# Altium schematic sheet P_Shift.SchDoc
size E
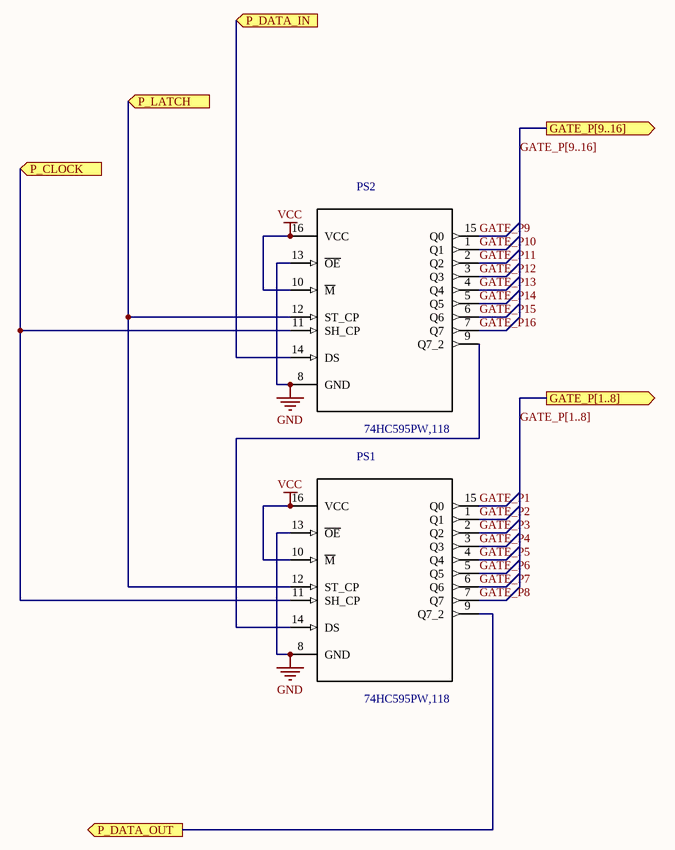
[diagram p0: P_Shift.SchDoc]

## Parts
PS1  74HC595PW,118  [SOP65P640X110-16N]
PS2  74HC595PW,118  [SOP65P640X110-16N]

## Ports
GATE_P[1..8] (out), GATE_P[9..16] (out), P_CLOCK (in), P_DATA_IN (in), P_DATA_OUT (out), P_LATCH (in)

## Nets
GND: PS1.8(GND) PS1.13(~{OE}) PS2.8(GND) PS2.13(~{OE})
VCC: PS1.10(M~{}) PS1.16(VCC) PS2.10(M~{}) PS2.16(VCC)
GATE_P1: PS1.15(Q0)
GATE_P2: PS1.1(Q1)
GATE_P3: PS1.2(Q2)
GATE_P4: PS1.3(Q3)
GATE_P5: PS1.4(Q4)
GATE_P6: PS1.5(Q5)
GATE_P7: PS1.6(Q6)
GATE_P8: PS1.7(Q7)
GATE_P9: PS2.15(Q0)
GATE_P10: PS2.1(Q1)
GATE_P11: PS2.2(Q2)
GATE_P12: PS2.3(Q3)
GATE_P13: PS2.4(Q4)
GATE_P14: PS2.5(Q5)
GATE_P15: PS2.6(Q6)
GATE_P16: PS2.7(Q7)
P_CLOCK: PS1.11(SH_CP) PS2.11(SH_CP) ; port P_CLOCK
P_DATA_IN: PS2.14(DS) ; port P_DATA_IN
P_DATA_OUT: PS1.9(Q7_2) ; port P_DATA_OUT
P_LATCH: PS1.12(ST_CP) PS2.12(ST_CP) ; port P_LATCH
NetPS1_14: PS1.14(DS) PS2.9(Q7_2)

## Buses and harness runs
bus GATE_P[1..8] = port GATE_P[1..8]
bus GATE_P[9..16] = port GATE_P[9..16]

## Library data of the parts
PS1 PS2 = 74HC595PW,118: 8-bit serial-in%2C serial or parallel-out shift register with output latches%3B 3-state; MF: NXP Semiconductors; MP: 74HC595PW,118; Price: 0.17 USD; Availability: Good; Package: TSSOP-16 NXP Semiconductors; Value: *